# EAGLE design reembox (EAGLE 6.2)
Reembox 1.1 The project "reembox" © 2013 Jonas Eickhoff is licensed under the Creative Commons Attribution-ShareAlike 3.0 Unported License: http://creativecommons.org/licenses/by-sa/3.0/
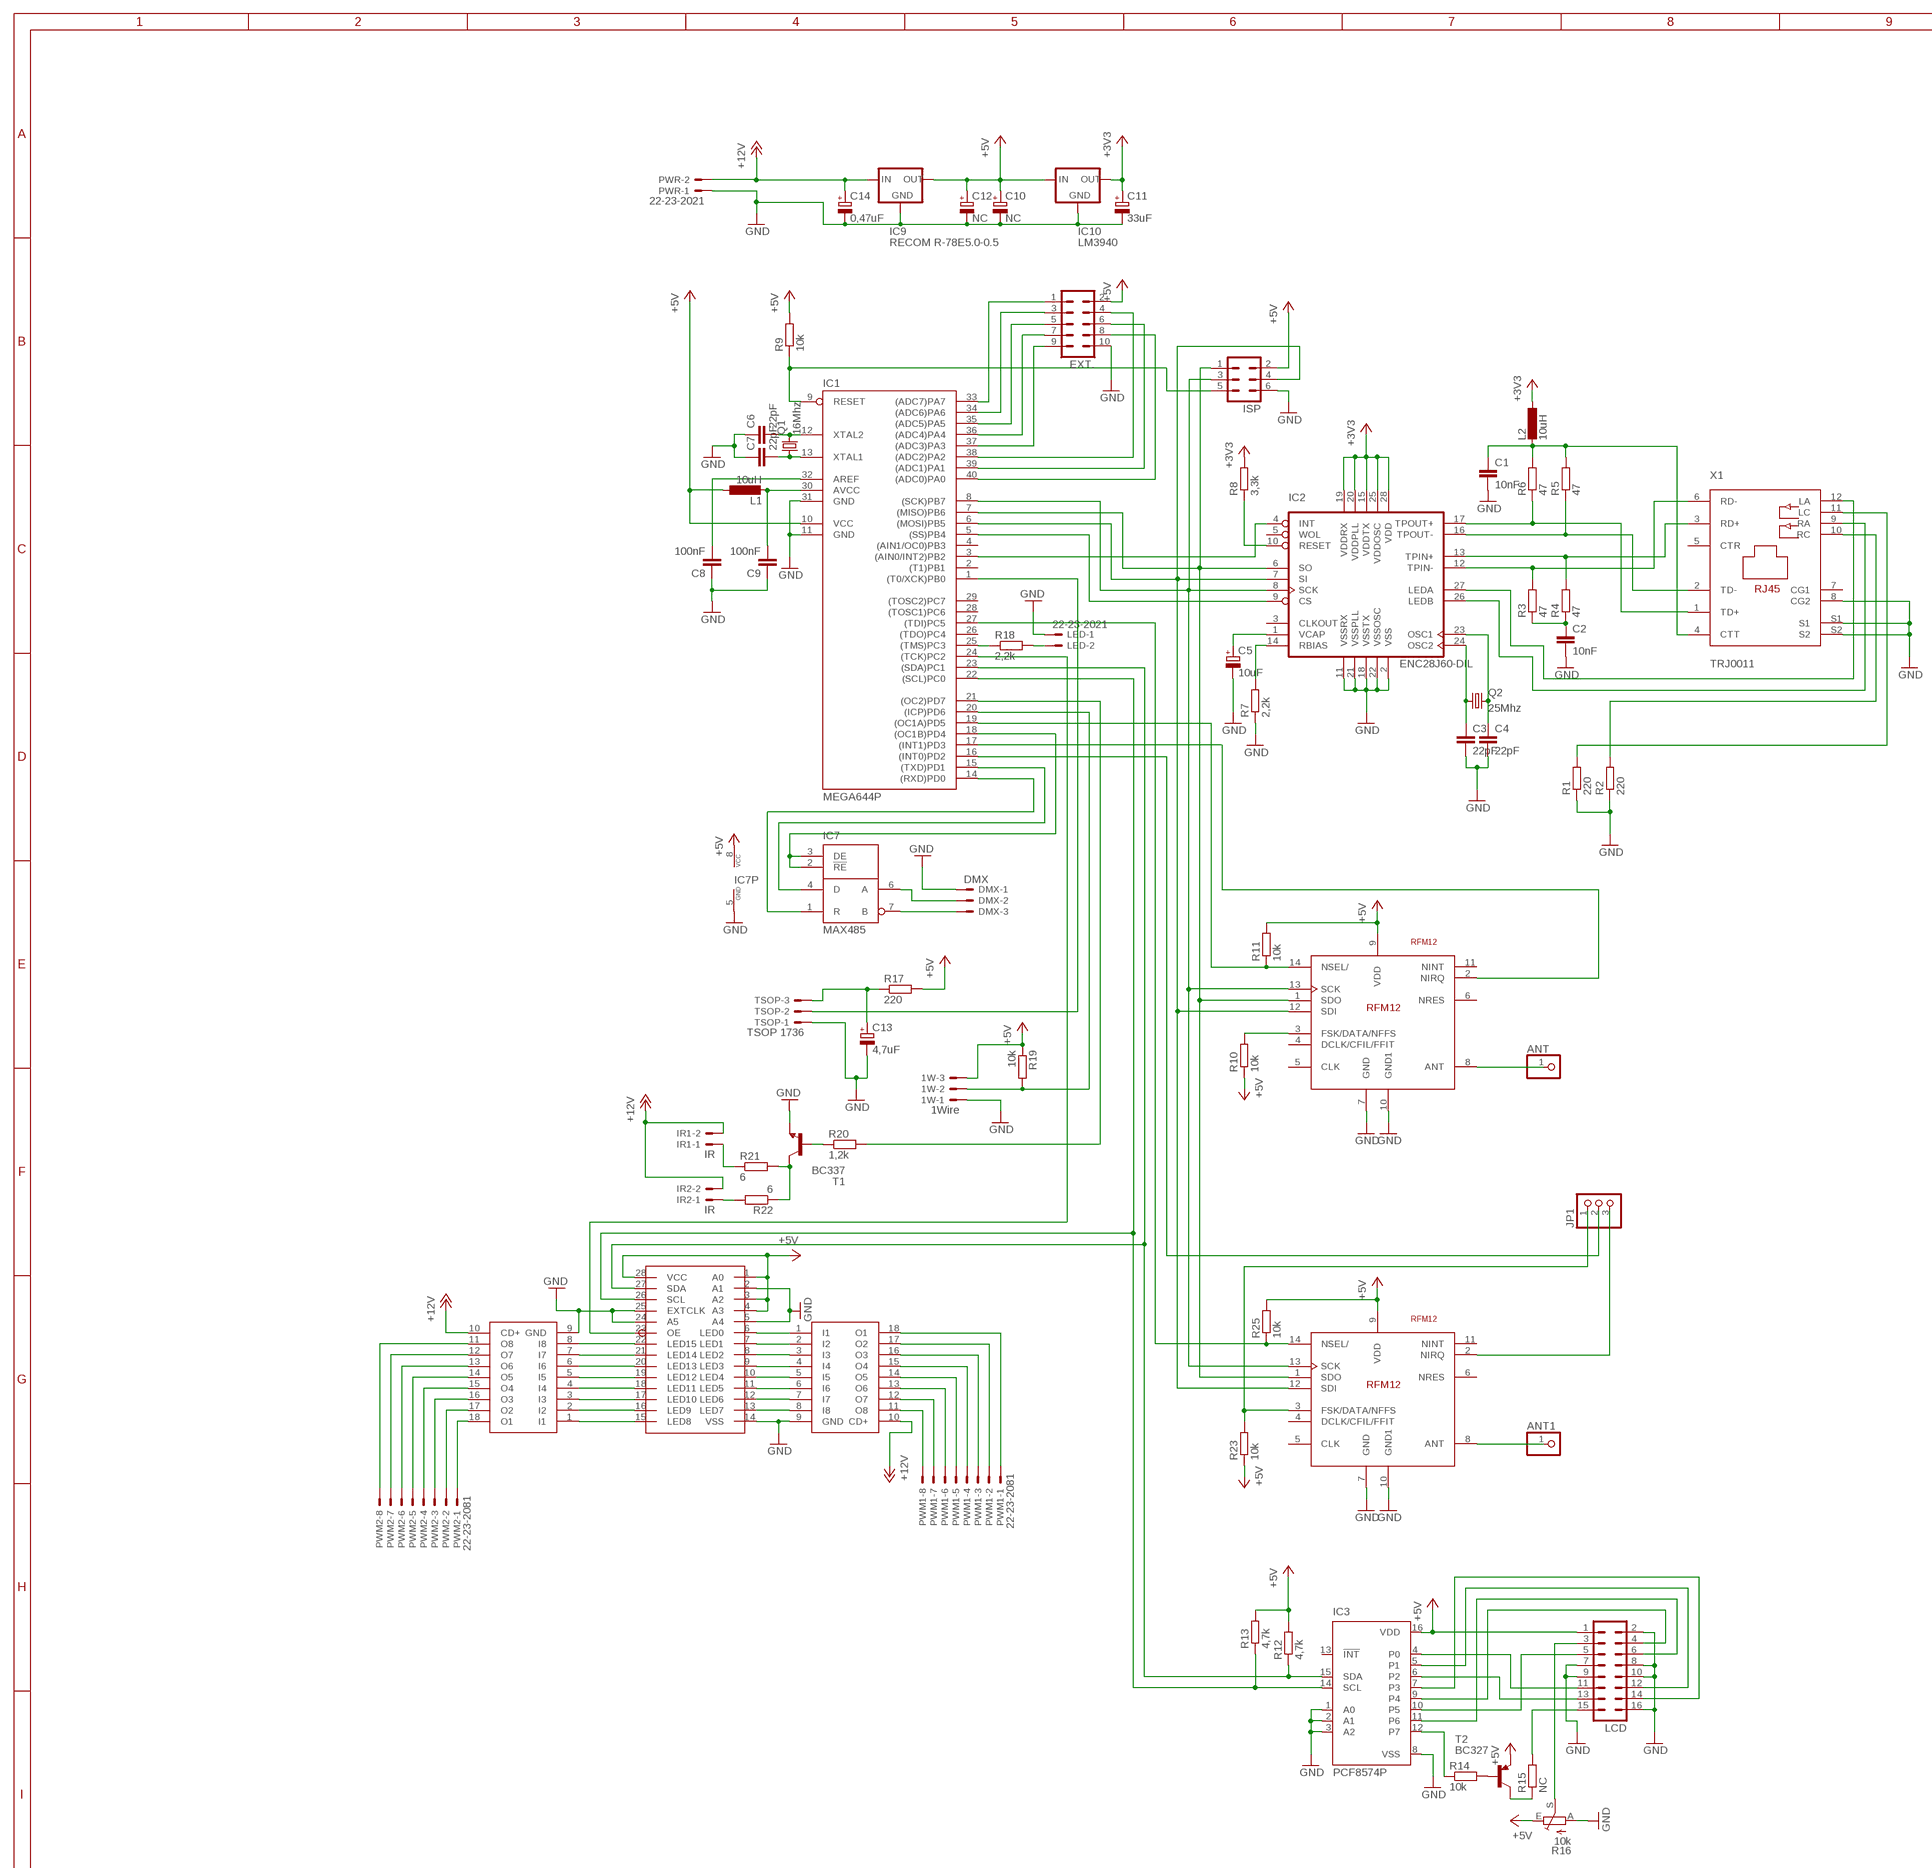
[diagram p0: schematic, sheet 1, part 1 of 2]
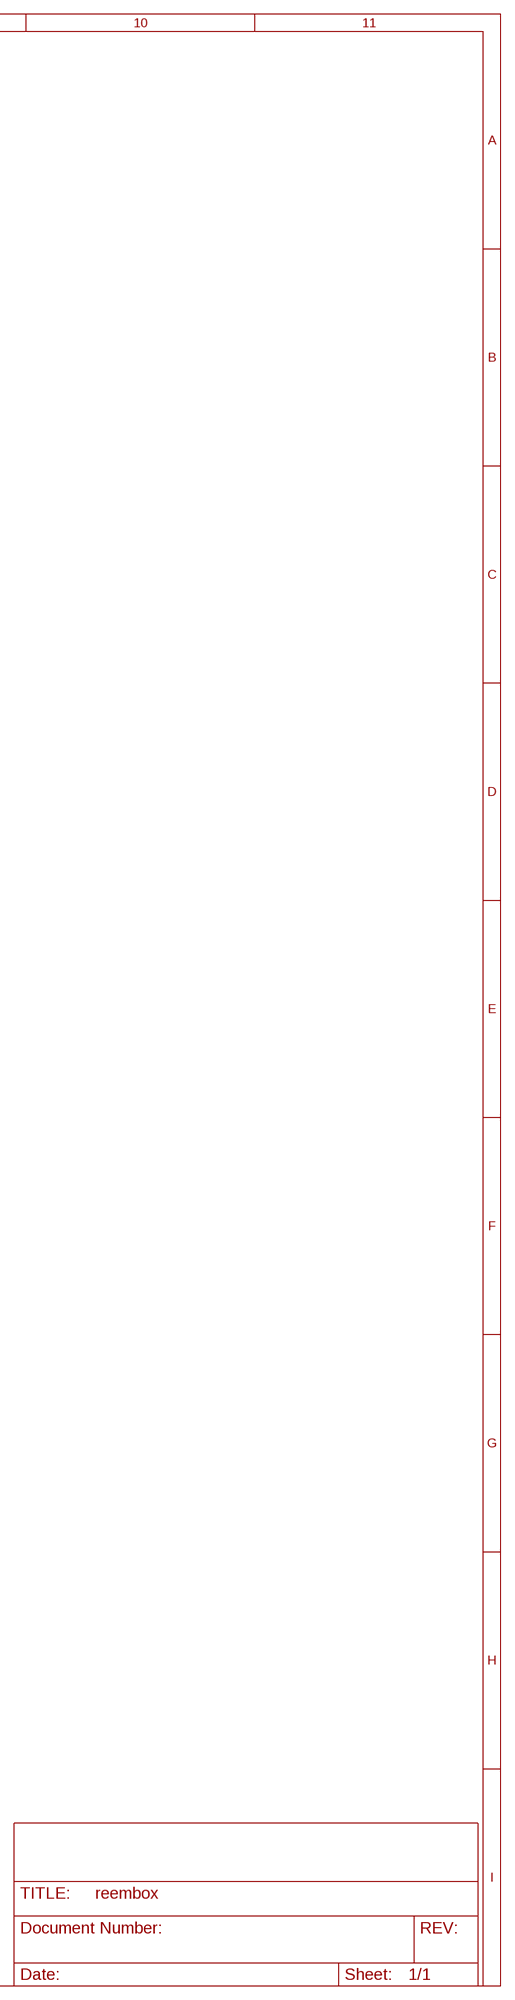
[diagram p1: schematic, sheet 1, part 2 of 2]

## Parts
1W  1Wire  CON-MOLEX_22-23-2031  [CON-MOLEX_22-23-2031]
ANT  PINHD-1X1  [1X01]
ANT1  PINHD-1X1  [1X01]
C1  10nF  C-EU050-025X075  [C050-025X075]
C2  10nF  C-EU050-025X075  [C050-025X075]
C3  22pF  C-EU050-024X044  [C050-024X044]
C4  22pF  C-EU050-024X044  [C050-024X044]
C5  10uF  CPOL-EUE2.5-6  [E2,5-6]
C6  22pF  C-EU050-024X044  [C050-024X044]
C7  22pF  C-EU050-024X044  [C050-024X044]
C8  100nF  C-EU050-025X075  [C050-025X075]
C9  100nF  C-EU050-025X075  [C050-025X075]
C10  NC  CPOL-EUE2.5-6  [E2,5-6]
C11  33uF  CPOL-EUE2.5-6  [E2,5-6]
C12  NC  CPOL-EUE2.5-6  [E2,5-6]
C13  4,7uF  CPOL-EUE2,5-6E  [E2,5-6E]
C14  0,47uF  CPOL-EUE2.5-6  [E2,5-6]
DMX  DMX  22-23-2031  [22-23-2031]
EXT.  ML10L  [ML10L]
IC1  MEGA644P  MEGA32-P  [DIL40]
IC2  ENC28J60-DIL  [DIL28-3]
IC3  PCF8574P  [DIL16]
IC4  PCA9685PW  [TSSOP28]
IC5  ULN2803  [DIL18]
IC6  ULN2803  [DIL18]
IC7  MAX485  75ALS176P  [DIL08]
IC8  RFM12  FRM12  [RFM12]
IC9  RECOM R-78E5.0-0.5  78XXS  [78XXS]
IC10  LM3940  78XXS  [78XXS]
IC11  RFM12  FRM12  [RFM12]
IR1  IR  22-23-2021  [22-23-2021]
IR2  IR  22-23-2021  [22-23-2021]
ISP  ML6  [ML6]
JP1  PINHD-1X3  [1X03]
L1  10uH  L-EU0207/2V  [0207/2V]
L2  10uH  L-EU0207/2V  [0207/2V]
LCD  ML16  [ML16]
LED  22-23-2021  [22-23-2021]
PWM1  22-23-2081  [22-23-2081]
PWM2  22-23-2081  [22-23-2081]
PWR  22-23-2021  [22-23-2021]
Q1  16Mhz  CRYSTALHC49U-V  [HC49U-V]
Q2  25Mhz  CRYSTALHC49U-V  [HC49U-V]
R1  220  R-EU_0207/2V  [0207/2V]
R2  220  R-EU_0207/2V  [0207/2V]
R3  47  R-EU_0207/2V  [0207/2V]
R4  47  R-EU_0207/2V  [0207/2V]
R5  47  R-EU_0207/2V  [0207/2V]
R6  47  R-EU_0207/2V  [0207/2V]
R7  2,2k  R-EU_0207/7  [0207/7]
R8  3,3k  R-EU_0207/10  [0207/10]
R9  10k  R-EU_0207/2V  [0207/2V]
R10  10k  R-EU_0207/10  [0207/10]
R11  10k  R-EU_0207/10  [0207/10]
R12  4,7k  R-EU_0207/10  [0207/10]
R13  4,7k  R-EU_0207/10  [0207/10]
R14  10k  R-EU_0207/10  [0207/10]
R15  NC  R-EU_0207/10  [0207/10]
R16  10k  TRIM_EU-PT10S  [PT-10S]
R17  220  R-EU_0207/2V  [0207/2V]
R18  2,2k  R-EU_0207/2V  [0207/2V]
R19  10k  R-EU_0207/10  [0207/10]
R20  1,2k  RCL_R-EU_0207/2V  [RCL_0207/2V]
R21  6  RCL_R-EU_0207/2V  [RCL_0207/2V]
R22  6  RCL_R-EU_0207/2V  [RCL_0207/2V]
R23  10k  R-EU_0207/10  [0207/10]
R25  10k  R-EU_0207/2V  [0207/2V]
T1  BC337  [TO92]
T2  BC327  [TO92]
TSOP  TSOP 1736  22-23-2031  [22-23-2031]
X1  TRJ0011  [TRJ0011]

## Nets
+3V3: C11.+ IC2.15(VDDTX) IC2.19(VDDRX) IC2.20(VDDPLL) IC2.25(VDDOSC) IC2.28(VDD) IC10.OUT L2.1 R8.2
+5V: 1W.3 C10.+ C12.+ EXT..2 IC1.10(VCC) IC3.16(VDD) IC4.1(A0) IC4.3(A2) IC4.4(A3) IC4.28(VCC) IC7.8(VCC) IC8.9(VDD) IC9.OUT IC10.IN IC11.9(VDD) ISP.2 L1.1 LCD.1 R9.2 R10.1 R11.2 R12.2 R13.2 R16.E R17.2 R19.1 R23.1 R25.2 T2.1(E)
+12V: C14.+ IC5.10(CD+) IC6.10(CD+) IC9.IN IR1.2 IR2.2 PWR.2
GND: 1W.1 C1.2 C2.2 C3.2 C4.2 C5.- C6.1 C7.1 C8.1 C9.1 C10.- C11.- C12.- C13.- C14.- DMX.1 EXT..10 IC1.11(GND) IC1.31(GND) IC2.2(VSS) IC2.11(VSSRX) IC2.18(VSSTX) IC2.21(VSSPLL) IC2.22(VSSOSC) IC3.1(A0) IC3.2(A1) IC3.3(A2) IC3.8(VSS) IC4.2(A1) IC4.5(A4) IC4.14(VSS) IC4.24(A5) IC4.25(EXTCLK) IC5.9(GND) IC6.9(GND) IC7.5(GND) IC8.7(GND) IC8.10(GND1) IC9.GND IC10.GND IC11.7(GND) IC11.10(GND1) ISP.6 LCD.2 LCD.7 LCD.8 LCD.9 LCD.10 LCD.16 LED.1 PWR.1 R1.1 R2.1 R7.1 R16.A T1.1(E) TSOP.1 X1.8(CG2) X1.S1 X1.S2
LED: IC1.1((T0/XCK)PB0) TSOP.2
N$1: IC2.17(TPOUT+) R6.1 X1.1(TD+)
N$2: IC2.16(TPOUT-) R5.1 X1.2(TD-)
N$3: IC2.13(TPIN+) R4.2 X1.3(RD+)
N$4: IC2.12(TPIN-) R3.2 X1.6(RD-)
N$5: IC2.27(LEDA) X1.12(LA)
N$6: IC2.26(LEDB) X1.9(RA)
N$7: R2.2 X1.10(RC)
N$8: R1.2 X1.11(LC)
N$9: C2.1 R3.1 R4.1
N$10: C3.1 IC2.24(OSC2) Q2.1
N$11: C4.1 IC2.23(OSC1) Q2.2
N$12: C1.1 L2.2 R5.2 R6.2 X1.4(CTT)
N$13: IC2.10(RESET) R8.1
N$14: IC2.14(RBIAS) R7.2
N$15: C5.+ IC2.1(VCAP)
N$16: C6.2 IC1.12(XTAL2) Q1.2
N$17: C7.2 IC1.13(XTAL1) Q1.1
N$18: IC1.5((SS)PB4) IC2.9(CS)
N$19: IC1.17((INT1)PD3) IC8.2(NIRQ)
N$20: IC1.27((TDI)PC5) IC11.14(NSEL/) R25.1
N$21: IC1.16((INT0)PD2) JP1.2
N$22: C8.2 IC1.32(AREF)
N$23: IC1.3((AIN0/INT2)PB2) IC2.4(INT)
N$24: IC1.9(RESET) ISP.5 R9.1
N$25: IC1.19((OC1A)PD5) IC8.14(NSEL/) R11.1
N$26: C9.2 IC1.30(AVCC) L1.2
N$27: DMX.2 IC7.6(A)
N$29: IC1.18((OC1B)PD4) IC7.2(!RE) IC7.3(DE)
N$30: DMX.3 IC7.7(B)
N$32: IC1.15((TXD)PD1) IC7.4(D)
N$33: IC1.14((RXD)PD0) IC7.1(R)
N$34: IC1.23((SDA)PC1) IC3.15(SDA) IC4.27(SDA) R12.1
N$35: IC1.22((SCL)PC0) IC3.14(SCL) IC4.26(SCL) R13.1
N$36: IC3.12(P7) R14.1
N$37: R14.2 T2.2(B)
N$38: R15.1 T2.3(C)
N$39: LCD.15 R15.2
N$40: IC3.4(P0) LCD.11
N$41: IC3.5(P1) LCD.12
N$42: IC3.6(P2) LCD.13
N$43: IC3.7(P3) LCD.14
N$44: IC3.9(P4) LCD.4
N$45: IC3.10(P5) LCD.5
N$46: IC3.11(P6) LCD.6
N$47: ANT.1 IC8.8(ANT)
N$48: IC1.24((TCK)PC2) IC4.23(OE)
N$49: LCD.3 R16.S
N$50: C13.+ R17.1 TSOP.3
N$51: IC4.15(LED8) IC5.1(I1)
N$52: IC1.21((OC2)PD7) R20.2
N$53: IC1.8((SCK)PB7) IC2.8(SCK) IC8.13(SCK) IC11.13(SCK) ISP.3
N$54: 1W.2 IC1.20((ICP)PD6) R19.2
N$55: R20.1 T1.2(B)
N$56: IC4.16(LED9) IC5.2(I2)
N$57: R21.2 R22.1 T1.3(C)
N$58: IR1.1 R21.1
N$59: IC4.17(LED10) IC5.3(I3)
N$60: IC4.18(LED11) IC5.4(I4)
N$61: IC4.19(LED12) IC5.5(I5)
N$62: IC4.20(LED13) IC5.6(I6)
N$63: IC4.21(LED14) IC5.7(I7)
N$64: IC4.22(LED15) IC5.8(I8)
N$65: IC4.6(LED0) IC6.1(I1)
N$66: IC4.8(LED2) IC6.3(I3)
N$67: IC4.7(LED1) IC6.2(I2)
N$68: IC4.10(LED4) IC6.5(I5)
N$69: IC4.9(LED3) IC6.4(I4)
N$70: IC4.12(LED6) IC6.7(I7)
N$71: IC4.11(LED5) IC6.6(I6)
N$72: IC4.13(LED7) IC6.8(I8)
N$73: IC6.13(O6) PWM1.6
N$74: IC6.17(O2) PWM1.2
N$75: IC5.18(O1) PWM2.1
N$76: IC5.17(O2) PWM2.2
N$77: IC5.16(O3) PWM2.3
N$78: IC5.15(O4) PWM2.4
N$79: IC5.14(O5) PWM2.5
N$80: IC5.13(O6) PWM2.6
N$81: IC5.12(O7) PWM2.7
N$82: IC5.11(O8) PWM2.8
N$83: IC6.11(O8) PWM1.8
N$84: IC6.12(O7) PWM1.7
N$85: IC6.14(O5) PWM1.5
N$86: IC6.15(O4) PWM1.4
N$87: IC6.16(O3) PWM1.3
N$88: IC6.18(O1) PWM1.1
N$89: IC1.25((TMS)PC3) R18.1
N$90: EXT..1 IC1.33((ADC7)PA7)
N$91: EXT..3 IC1.34((ADC6)PA6)
N$92: EXT..5 IC1.35((ADC5)PA5)
N$93: EXT..7 IC1.36((ADC4)PA4)
N$94: EXT..9 IC1.37((ADC3)PA3)
N$95: EXT..4 IC1.38((ADC2)PA2)
N$96: EXT..6 IC1.39((ADC1)PA1)
N$97: EXT..8 IC1.40((ADC0)PA0)
N$98: IC1.6((MOSI)PB5) IC2.7(SI) IC8.12(SDI) IC11.12(SDI) ISP.4
N$99: LED.2 R18.2
N$100: IR2.1 R22.2
N$101: IC1.7((MISO)PB6) IC2.6(SO) IC8.1(SDO) IC11.1(SDO) ISP.1
N$103: IC11.3(FSK/DATA/NFFS) JP1.1 R23.2
N$104: IC11.2(NIRQ) JP1.3
N$105: ANT1.1 IC11.8(ANT)
N$106: IC8.3(FSK/DATA/NFFS) R10.2
Unconnected: IC1.2((T1)PB1) IC1.4((AIN1/OC0)PB3) IC1.26((TDO)PC4) IC1.28((TOSC1)PC6) IC1.29((TOSC2)PC7) IC2.3(CLKOUT) IC2.5(WOL) IC3.13(!INT) IC8.4(DCLK/CFIL/FFIT) IC8.5(CLK) IC8.6(NRES) IC8.11(NINT) IC11.4(DCLK/CFIL/FFIT) IC11.5(CLK) IC11.6(NRES) IC11.11(NINT) X1.5(CTR) X1.7(CG1)

## Notes on the sheet
- This project "reembox" © 2013 Jonas Eickhoff is licensed under the Creative Commons Attribution-ShareAlike 3.0 Unported License: http://creativecommons.org/licenses/by-sa/3.0/

## Library data of the parts
1W = NetIO:CON-MOLEX_22-23-2031: .100" (2.54mm) Center Header - 3 Pin; MF: MOLEX; MPN: 22-23-2031; OC_FARNELL: 1462950; OC_NEWARK: 30C0862
ANT ANT1 = pinhead:PINHD-1X1: PIN HEADER
C1-C4 C6-C9 = rcl:C-EU: CAPACITOR, European symbol
C5 C10-C14 = rcl:CPOL-EU: POLARIZED CAPACITOR, European symbol
DMX TSOP = con-molex:22-23-2031: .100" (2.54mm) Center Header - 3 Pin; MF: MOLEX; MPN: 22-23-2031; OC_FARNELL: 1462950; OC_NEWARK: 30C0862
EXT. = con-ml:ML10L: HARTING; OC_FARNELL: unknown; OC_NEWARK: unknown
IC1 = atmel:MEGA32-P: MICROCONTROLLER 32 Kbytes FLASH 2 Kbytes SRAM 1 Kbytes EEPROM USART 8-channel 10 bit ADC Source: www.atmel.com .. doc2503.pdf; MPN: ATMEGA32-16PU; OC_FARNELL: 1661729; OC_NEWARK: 51P1794
IC2 = enc28j60centered:ENC28J60-*: Microchip 10Mbit Ethernet controller with SPI interface Improved SOIC28 layout (pads in 0.01 raster, pin1 slightly smaller). Pin 6 (SO) changed from Out (paralleling several Outs gives an error) to OC. Author: Profi from mikrocontroller.net - forum Date: 2006.0827
IC3 = micro-philips:PCF8574: I2C-Bus Remote 8-bit I/O expander http://www.semiconductors.philips.com/acrobat_download/datasheets/PCF8574_4.pdf; MPN: PCF8574PN; OC_FARNELL: 204020; OC_NEWARK: 11N8515
IC4 = PCA9685PW:PCA9685PW
IC5 IC6 = ULN2803:ULN2803
IC7 = texas:75ALS176: DIFFERENTIAL BUS TRANSCEIVERS TIA/EIA-422-B, TIA/EIA-422-B + TIA/EIA-422-B TIA/EIA-422-B Operate at Data Rates up to 35 Mbaud Source: http://focus.ti.com/lit/ds/symlink/sn65als176.pdf; MF: TEXAS INSTRUMENTS; MPN: SN75ALS176P; OC_FARNELL: 1103021; OC_NEWARK: 60K6915
IC8 IC11 = RFM12:FRM12
IC9 IC10 = v-reg:78XXS: VOLTAGE REGULATOR
IR1 IR2 LED PWR = con-molex:22-23-2021: .100" (2.54mm) Center Header - 2 Pin; MF: MOLEX; MPN: 22-23-2021; OC_FARNELL: 1462926; OC_NEWARK: 25C3832
ISP = con-ml:ML6: HARTING; OC_FARNELL: unknown; OC_NEWARK: unknown
JP1 = pinhead:PINHD-1X3: PIN HEADER
L1 L2 = rcl:L-EU: INDUCTOR, European symbol
LCD = con-ml:ML16: HARTING; OC_FARNELL: unknown; OC_NEWARK: unknown
PWM1 PWM2 = con-molex:22-23-2081: .100" (2.54mm) Center Header - 8 Pin; MF: MOLEX; MPN: 22-23-2081; OC_FARNELL: 1756826; OC_NEWARK: 01C7592
Q1 Q2 = crystal:CRYSTAL: CRYSTAL; OC_FARNELL: 1666969; OC_NEWARK: unknown
R1-R6 R8-R15 R17-R19 R23 R25 = rcl:R-EU_: RESISTOR, European symbol
R7 = resistor:R-EU_: RESISTOR, European symbol
R16 = pot:TRIM_EU-: POTENTIOMETER
R20-R22 = NetIO:RCL_R-EU_: RESISTOR, European symbol
T1 = transistor:BC337: NPN TRANSISTOR
T2 = transistor-pnp:BC327: PNP Transistor
X1 = trj0011:TRJ0011

## Board
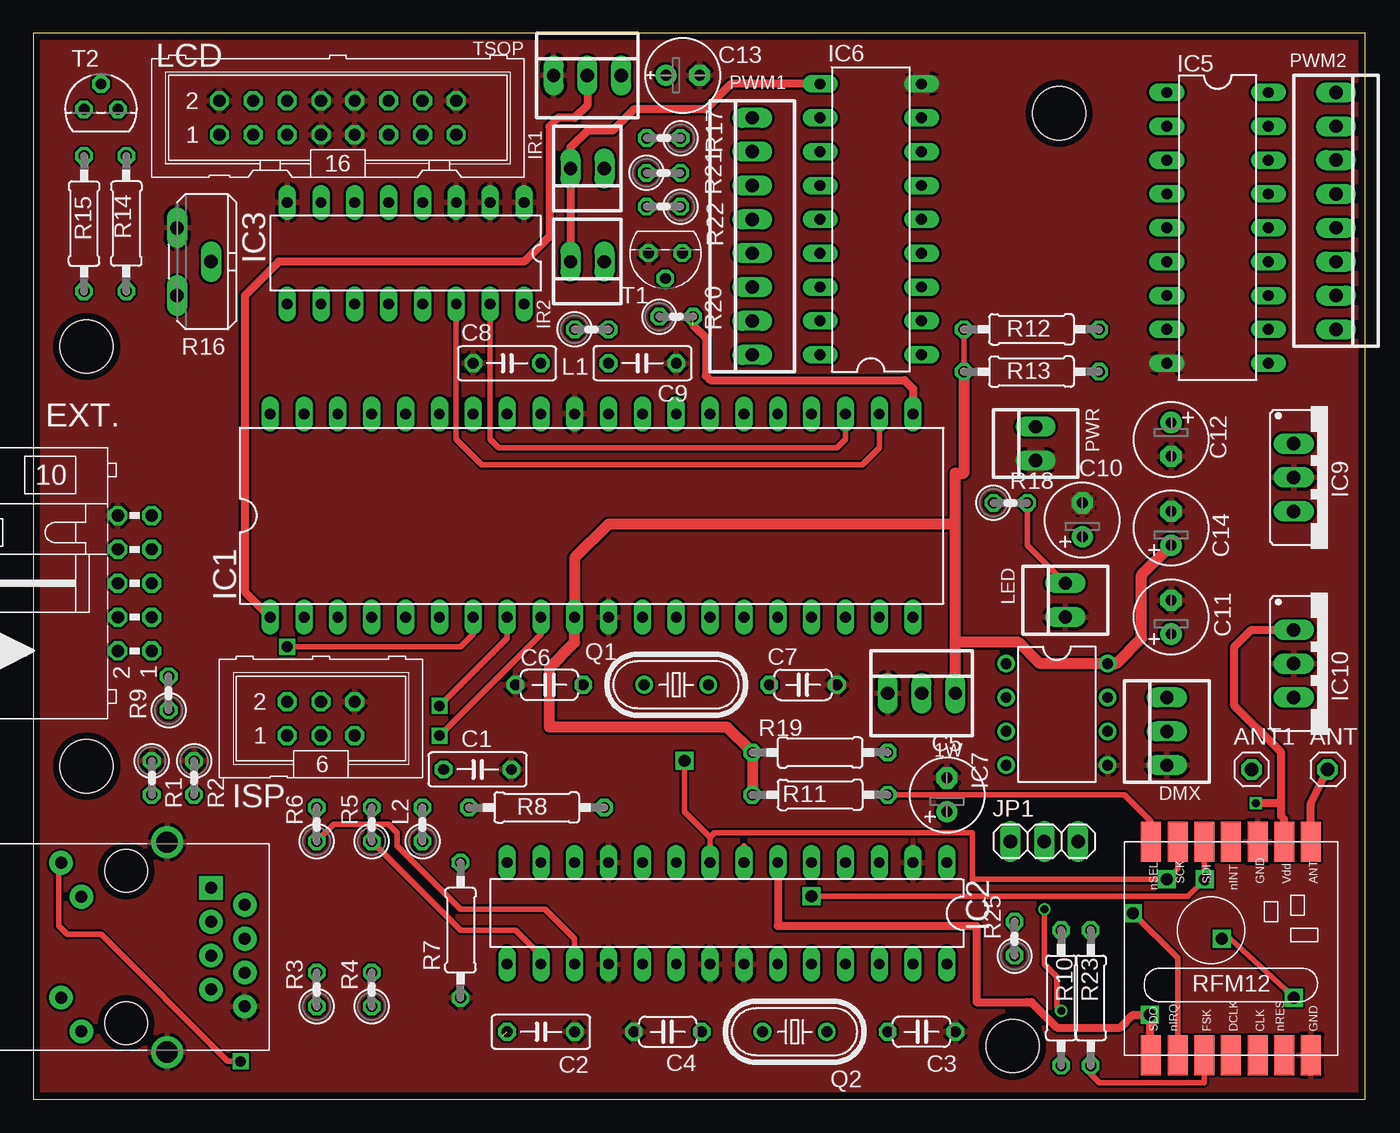
[diagram p2: board, top side]
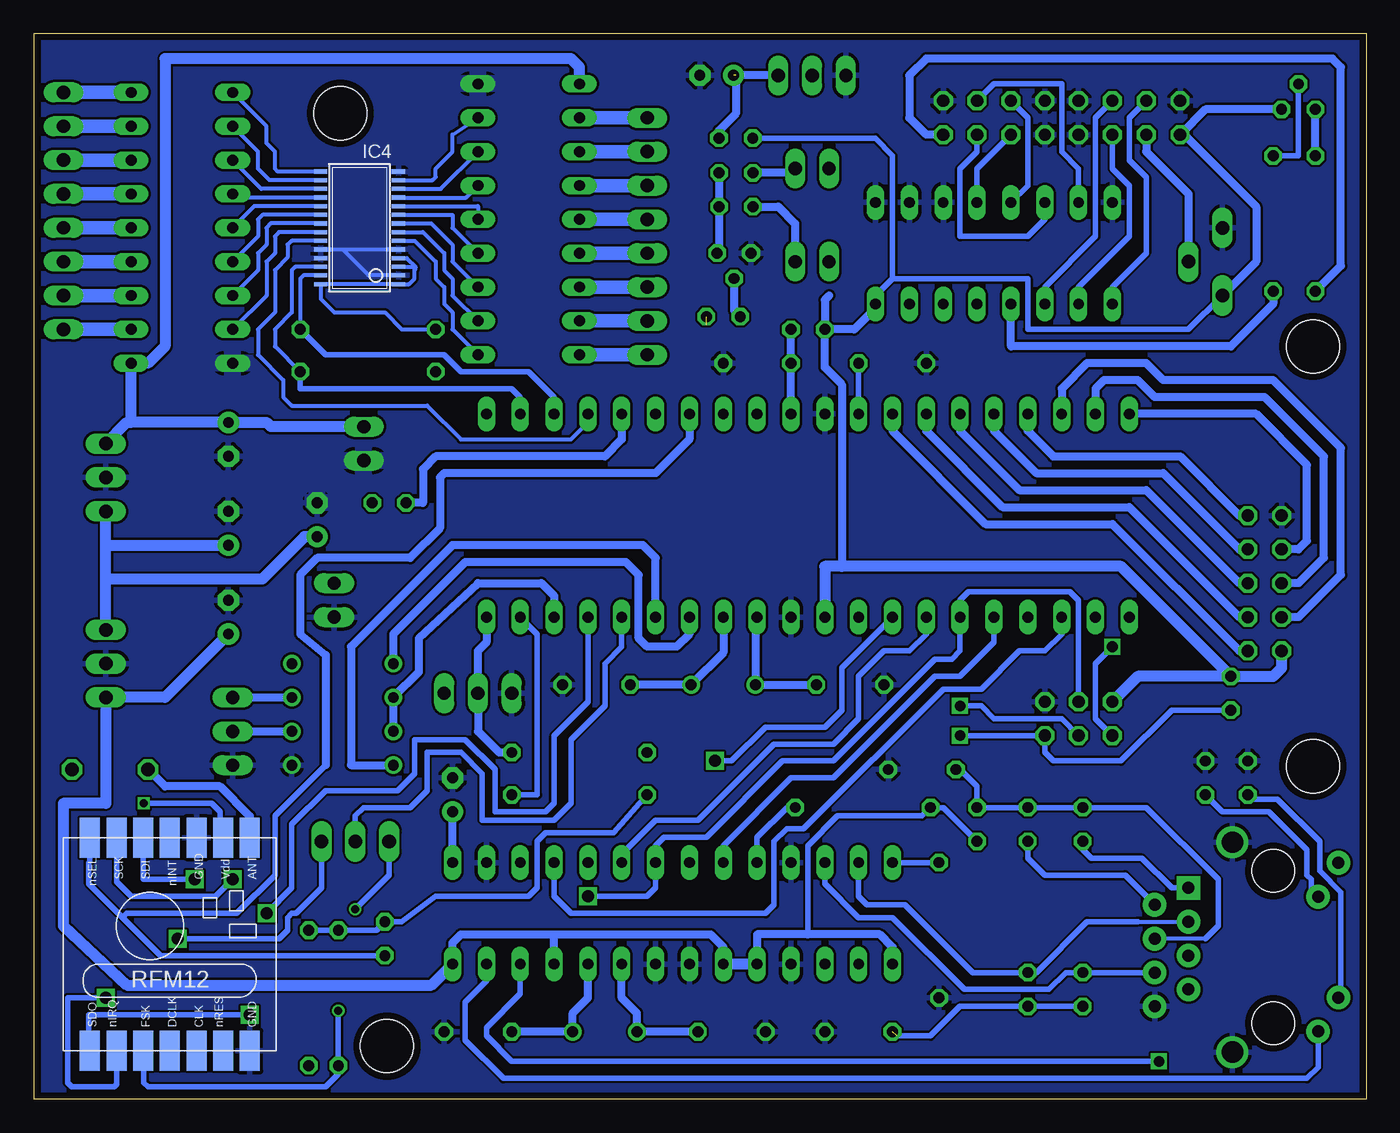
[diagram p3: board, bottom side, seen from below]

Size 100 x 80 mm. Coordinates in mm from the lower left corner, seen from the top.
Outline: 0,0 100,0 100,80 0,80 0,0
Copper layers (1*16): Top 0.035mm / dielectric 1.5mm / Bottom 0.035mm
Design rules: minimum track width 7mil, minimum drill 12mil, track to track 7mil, track to pad 7mil, pad to pad 7mil, via to via 7mil, smd to smd 0mil, copper to edge 20mil, drill to drill 10mil, minimum pad ring 10mil, minimum via ring 6mil, stop-mask expansion 2mil, vias tented up to drill 25mil, thermal gap 10mil
Holes 4 mm at 4,25 4,56.5 77,74 73.5,4

### Footprints (pad centres in the part's own frame; a part is rotated, then mirrored left to right if it is on the bottom)
CON-MOLEX_22-23-2031 = drill 1 long: 1 -2.54,0; 2 0,0; 3 2.54,0
1X01 = drill 1.016 octagon: 1 0,0
C050-025X075 = drill 0.813 octagon: 1 -2.54,0; 2 2.54,0
C050-024X044 = drill 0.813 octagon: 1 -2.54,0; 2 2.54,0
E2,5-6 = drill 0.813 pad 1.6: + -1.27,0 | drill 0.813 pad 1.6 octagon: - 1.27,0
E2,5-6E = drill 0.813 pad 1.575: + -1.27,0 | drill 0.813 pad 1.575 octagon: - 1.27,0
22-23-2031 = drill 1 long: 1 -2.54,0; 2 0,0; 3 2.54,0
ML10L = drill 0.914 octagon: 1 -5.08,-1.27; 2 -5.08,1.27; 3 -2.54,-1.27; 4 -2.54,1.27; 5 0,-1.27; 6 0,1.27; 7 2.54,-1.27; 8 2.54,1.27; 9 5.08,-1.27; 10 5.08,1.27
DIL40 = drill 0.813 long: 1 -24.13,-7.62; 2 -21.59,-7.62; 3 -19.05,-7.62; 4 -16.51,-7.62; 5 -13.97,-7.62; 6 -11.43,-7.62; 7 -8.89,-7.62; 8 -6.35,-7.62; 9 -3.81,-7.62; 10 -1.27,-7.62; 11 1.27,-7.62; 12 3.81,-7.62; 13 6.35,-7.62; 14 8.89,-7.62; 15 11.43,-7.62; 16 13.97,-7.62; 17 16.51,-7.62; 18 19.05,-7.62; 19 21.59,-7.62; 20 24.13,-7.62; 21 24.13,7.62; 22 21.59,7.62; 23 19.05,7.62; 24 16.51,7.62; 25 13.97,7.62; 26 11.43,7.62; 27 8.89,7.62; 28 6.35,7.62; 29 3.81,7.62; 30 1.27,7.62; 31 -1.27,7.62; 32 -3.81,7.62; 33 -6.35,7.62; 34 -8.89,7.62; 35 -11.43,7.62; 36 -13.97,7.62; 37 -16.51,7.62; 38 -19.05,7.62; 39 -21.59,7.62; 40 -24.13,7.62
DIL28-3 = drill 0.813 long: 1 -16.51,-3.81; 2 -13.97,-3.81; 3 -11.43,-3.81; 4 -8.89,-3.81; 5 -6.35,-3.81; 6 -3.81,-3.81; 7 -1.27,-3.81; 8 1.27,-3.81; 9 3.81,-3.81; 10 6.35,-3.81; 11 8.89,-3.81; 12 11.43,-3.81; 13 13.97,-3.81; 14 16.51,-3.81; 15 16.51,3.81; 16 13.97,3.81; 17 11.43,3.81; 18 8.89,3.81; 19 6.35,3.81; 20 3.81,3.81; 21 1.27,3.81; 22 -1.27,3.81; 23 -3.81,3.81; 24 -6.35,3.81; 25 -8.89,3.81; 26 -11.43,3.81; 27 -13.97,3.81; 28 -16.51,3.81
DIL16 = drill 0.813 long: 1 -8.89,-3.81; 2 -6.35,-3.81; 3 -3.81,-3.81; 4 -1.27,-3.81; 5 1.27,-3.81; 6 3.81,-3.81; 7 6.35,-3.81; 8 8.89,-3.81; 9 8.89,3.81; 10 6.35,3.81; 11 3.81,3.81; 12 1.27,3.81; 13 -1.27,3.81; 14 -3.81,3.81; 15 -6.35,3.81; 16 -8.89,3.81
TSSOP28 = smd 0.305 x 0.991: 1 -4.225,-2.918; 2 -3.575,-2.918; 3 -2.925,-2.918; 4 -2.275,-2.918; 5 -1.625,-2.918; 6 -0.975,-2.918; 7 -0.325,-2.918; 8 0.325,-2.918; 9 0.975,-2.918; 10 1.625,-2.918; 11 2.275,-2.918; 12 2.925,-2.918; 13 3.575,-2.918; 14 4.225,-2.918; 15 4.225,2.918; 16 3.575,2.918; 17 2.925,2.918; 18 2.275,2.918; 19 1.625,2.918; 20 0.975,2.918; 21 0.325,2.918; 22 -0.325,2.918; 23 -0.975,2.918; 24 -1.625,2.918; 25 -2.275,2.918; 26 -2.925,2.918; 27 -3.575,2.918; 28 -4.225,2.918
DIL18 = drill 0.813 long: 1 -10.16,-3.81; 2 -7.62,-3.81; 3 -5.08,-3.81; 4 -2.54,-3.81; 5 0,-3.81; 6 2.54,-3.81; 7 5.08,-3.81; 8 7.62,-3.81; 9 10.16,-3.81; 10 10.16,3.81; 11 7.62,3.81; 12 5.08,3.81; 13 2.54,3.81; 14 0,3.81; 15 -2.54,3.81; 16 -5.08,3.81; 17 -7.62,3.81; 18 -10.16,3.81
DIL08 = drill 0.813 pad 1.27: 1 -3.81,-3.81; 2 -1.27,-3.81; 3 1.27,-3.81; 4 3.81,-3.81; 5 3.81,3.81; 6 1.27,3.81; 7 -1.27,3.81; 8 -3.81,3.81
RFM12 = smd 1.5 x 3: 1 -5,-10; 2 -3,-10; 3 -1,-10; 4 1,-10; 5 3,-10; 6 5,-10; 7 7,-10; 8 7,6; 9 5,6; 10 3,6; 11 1,6; 12 -1,6; 13 -3,6; 14 -5,6
78XXS = drill 1.016 long: GND 0,-2.54; IN -2.54,-2.54; OUT 2.54,-2.54
22-23-2021 = drill 1 long: 1 -1.27,0; 2 1.27,0
ML6 = drill 0.914 octagon: 1 -2.54,-1.27; 2 -2.54,1.27; 3 0,-1.27; 4 0,1.27; 5 2.54,-1.27; 6 2.54,1.27
1X03 = drill 1.016 long: 1 -2.54,0; 2 0,0; 3 2.54,0
0207/2V = drill 0.813 octagon: 1 -1.27,0; 2 1.27,0
ML16 = drill 0.914 octagon: 1 -8.89,-1.27; 2 -8.89,1.27; 3 -6.35,-1.27; 4 -6.35,1.27; 5 -3.81,-1.27; 6 -3.81,1.27; 7 -1.27,-1.27; 8 -1.27,1.27; 9 1.27,-1.27; 10 1.27,1.27; 11 3.81,-1.27; 12 3.81,1.27; 13 6.35,-1.27; 14 6.35,1.27; 15 8.89,-1.27; 16 8.89,1.27
22-23-2081 = drill 1 long: 1 -8.89,0; 2 -6.35,0; 3 -3.81,0; 4 -1.27,0; 5 1.27,0; 6 3.81,0; 7 6.35,0; 8 8.89,0
HC49U-V = drill 0.813: 1 -2.413,0; 2 2.413,0
0207/10 = drill 0.813 octagon: 1 -5.08,0; 2 5.08,0
PT-10S = drill 1.016 long: A -2.54,-1.27; E 2.54,-1.27; S 0,1.27
RCL_0207/2V = drill 0.813 octagon: 1 -1.27,0; 2 1.27,0
TO92 = drill 0.813 octagon: 1 1.27,0; 2 0,1.905; 3 -1.27,0
TRJ0011 = drill 0.9 pad 1.778 square: 1 4.445,-6.35 | drill 0.9 pad 1.778: 2 3.175,-8.89; 3 1.905,-6.35; 4 0.635,-8.89; 5 -0.635,-6.35; 6 -1.905,-8.89; 7 -3.175,-6.35; 8 -4.445,-8.89; 9 6.325,4.902; 10 3.785,3.378; 11 -3.785,4.902; 12 -6.325,3.378 | drill 1.6: S1 -7.874,-3.048; S2 7.874,-3.048 | hole 3.2: -5.715,0; 5.715,0

### Placement (x,y rotation side)
1W  66.67,30.48 0 top
ANT  97.16,24.77 0 top
ANT1  91.44,24.77 0 top
C1  33.34,24.77 0 top
C2  38.1,5.08 0 top
C3  66.67,5.08 0 top
C4  47.62,5.08 180 top
C5  68.58,22.86 90 top
C6  38.73,31.11 0 top
C7  57.78,31.11 180 top
C8  35.56,55.24 0 top
C9  45.72,55.24 180 top
C10  78.74,43.5 90 top
C11  85.41,36.2 90 top
C12  85.41,42.86 90 top
C13  48.75,76.85 0 top
C14  85.41,49.53 270 top
DMX  85.09,27.62 90 top
EXT.  7.62,38.73 90 top
IC1  41.91,43.81 0 top
IC2  52.07,13.97 180 top
IC3  27.94,63.5 180 top
IC4  75.56,65.41 90 bottom
IC5  88.9,65.41 270 top
IC6  62.87,66.04 90 top
IC7  76.83,28.89 270 top
IC8  88.9,13.34 0 top
IC9  97.16,46.67 270 top
IC10  97.16,32.7 270 top
IC11  90.81,13.65 0 bottom
IR1  41.59,69.85 180 top
IR2  41.59,62.87 180 top
ISP  21.59,28.57 0 top
JP1  75.88,19.37 0 top
L1  41.91,57.78 0 top
L2  29.21,20.64 90 top
LCD  22.86,73.66 0 top
LED  77.47,37.47 90 top
PWM1  53.98,64.77 90 top
PWM2  97.79,66.67 270 top
PWR  75.25,49.21 90 top
Q1  48.26,31.11 180 top
Q2  57.15,5.08 180 top
R1  8.89,24.13 270 top
R2  12.06,24.13 270 top
R3  21.27,8.26 90 top
R4  25.4,8.26 90 top
R5  25.4,20.64 90 top
R6  21.27,20.64 90 top
R7  2,2k  [0207/10]  32.07,12.7 90 top
R8  37.78,21.91 180 top
R9  10.16,30.48 90 top
R10  79.38,7.62 270 top
R11  59.05,22.86 180 top
R12  74.93,57.78 180 top
R13  74.93,54.61 180 top
R14  6.99,65.72 90 top
R15  3.81,65.72 270 top
R16  12.06,62.87 270 top
R17  47.31,72.14 180 top
R18  73.34,44.77 0 top
R19  59.05,26.04 0 top
R20  48.26,58.74 0 top
R21  47.31,69.53 0 top
R22  47.31,66.99 180 top
R23  77.15,7.62 270 top
R25  73.66,12.06 90 top
T1  47.45,63.51 180 top
T2  5.08,74.3 0 top
TSOP  41.59,76.83 0 top
X1  6.99,11.43 90 top

### Tracks (layer width: path | path; a pad name or v marks a point on that pad's centre or on a via)
+3V3
  Bottom 0.406: L2.1 31.75,21.91 R8.2 33.34,21.27 39.69,21.27 41.91,19.05 41.91,12.38
  Bottom 0.61: IC2.25 60.96,12.38 | 60.96,12.38 49.21,12.38 48.26,11.43 IC2.20 | IC2.15 35.56,11.43 36.51,12.38 41.91,12.38 45.72,12.38 IC2.19 | IC2.28 68.58,11.75 67.94,12.38 60.96,12.38
  Bottom 0.813: IC2.19 IC2.20 | C11.+ 90.17,30.16 IC10.OUT 94.61,22.23 97.79,22.23 97.79,13.02 93.03,8.57 70.17,8.57 IC2.28
+5V  (via drill 0.6)
  Top 0.406: R12.2 R13.2
  Top 0.61: IC8.9 93.9,21.04 93.66,21.27 93.66,22.23 | 93.66,22.23 93.66,26.04 90.17,29.53 90.17,33.97 91.44,35.24 IC10.IN | 93.66,22.23 v91.76,22.23
  Top 0.813: R11.2 R19.1 52.07,27.94 38.73,27.94 38.73,32.38 40.64,34.29 IC1.10 40.64,40.64 43.18,43.18 69.22,43.18 | 69.22,43.18 69.22,46.99 69.85,46.99 R13.2 | C12.+ 83.19,39.37 83.19,34.61 81.28,32.7 IC7.8 75.56,32.7 73.98,34.29 69.22,34.29 | 1W.3 69.22,34.29 | 69.22,34.29 69.22,43.18
  Bottom 0.305: R12.2 72.39,57.78 73.66,59.05 77.47,59.05 78.48,60.07 IC4.28 IC4.1 71.85,61.18 71.44,61.59 71.44,62.23 71.37,62.48 | IC4.3 71.37,62.48 | IC4.4 72.02,63.13 71.37,62.48
  Bottom 0.406: IC3.16 36.83,60.33 35.56,61.59 | 35.56,61.59 25.4,61.59 25.4,57.78 13.34,57.78 R16.E | R11.2 56.52,20 61.59,20 62.23,19.37 62.23,15.88 62.87,15.24 69.85,15.24 72.39,13.34 R25.2 74.3,12.7 R23.1 R10.1 | R17.2 36.83,72.14 35.56,70.8 35.56,61.59 | IC11.9 86.04,19.89 86.04,21.59 86.68,22.23 v91.76,22.23
  Bottom 0.61: T2.1 12.06,74.3 LCD.1 13.65,72.39 8.26,66.99 8.26,62.87 R16.E | IC3.16 36.83,59.37 38.42,57.78 L1.1 | L1.1 40.64,54.93 39.37,53.66 39.37,40.01 | 40.32,60.33 40.64,60.01 L1.1
  Bottom 0.813: R9.2 18.41,40.01 39.37,40.01 40.64,40.01 IC1.10 | R9.2 6.99,31.75 6.35,32.38 EXT..2 | R9.2 17.14,31.75 ISP.2 | IC10.IN 94.61,39.05 | 94.61,39.05 94.61,41.59 | 94.61,41.59 IC9.OUT | 94.61,41.59 C12.+ | C10.+ 79.69,42.23 82.87,39.05 94.61,39.05
+12V
  Top 0.61: IC6.10 52.39,76.2 50.48,74.3 45.09,74.3 43.5,72.71 41.59,72.71 40.32,71.44 IR1.2 IR2.2
  Bottom 0.813: IC6.10 59.05,77.47 59.69,78.11 90.17,78.11 90.17,56.52 91.44,55.24 IC5.10 92.71,50.8 | PWR.2 82.23,50.48 82.55,50.8 C14.+ 92.71,50.8 | IC9.IN 93.03,50.8 92.71,50.8
GND
  Bottom 0.305: IC4.24 76.83,63.78 | 76.83,63.78 IC4.5 | IC4.2 74.89,61.83 76.83,63.78
  pour Bottom: 63.5,78.11 63.5,73.66 70.48,73.66 70.48,78.11
  pour Bottom: 83.19,52.07 83.19,58.42 88.27,58.42 88.27,52.07
  pour Bottom: 0,80.01 100.01,80.01 100.01,0 0,0
  pour Top: 0,80.01 100.01,80.01 100.01,0 0,0
  pour Top: 63.82,78.11 63.82,74.61 70.8,73.98 70.8,78.11
  pour Top: 81.6,57.15 81.6,53.66 88.58,53.02 88.58,57.15
  pour Bottom: 72.07,49.21 72.07,44.77 79.06,44.77 79.06,49.21
  pour Top: 72.07,48.58 72.07,45.09 79.06,44.45 79.06,48.58
LED
  Top 0.61: IC1.1 15.88,38.1 15.88,60.33 18.41,62.87 36.83,62.87 38.73,64.77 38.73,73.03 39.37,73.66 40.64,73.66 41.59,74.61 TSOP.2
N$1
  Top 0.406: IC2.17 40.64,12.06 38.42,14.29 32.07,14.29 27.3,19.05 27.3,20 26.67,20.64 22.54,20.64 R6.1
  Bottom 0.406: X1.1 14.61,15.88 16.83,18.1 20.64,18.1 21.27,18.73 R6.1
N$2
  Top 0.406: IC2.16 38.1,10.79 36.2,12.7 32.07,12.7 R5.1
  Bottom 0.406: R5.1 25.4,18.1 24.13,16.83 18.1,16.83 X1.2
N$3
  Bottom 0.305: 17.14,13.34 X1.3
  Bottom 0.406: IC2.13 38.1,15.24 37.47,14.61 34.61,14.61 29.53,9.53 R4.2 24.77,9.53 20.95,13.34 17.14,13.34
N$4
  Bottom 0.406: X1.6 R3.2 22.54,9.53 23.81,8.26 30.16,8.26 35.56,13.65 38.1,13.65 40.64,16.19 IC2.12
N$5
  Bottom 0.406: IC2.27 66.04,8.89 67.63,7.3 67.63,4.45 64.77,1.59 4.45,1.59 3.61,2.43 X1.12
N$6  (via drill 0.8)
  Top 0.406: v15.56,2.86 14.61,2.86 5.08,12.38 2.54,12.38 1.91,13.02 1.91,17.58 X1.9
  Bottom 0.406: v15.56,2.86 64.14,2.86 66.04,4.76 66.04,5.4 63.5,7.94 IC2.26
N$7
  Bottom 0.406: R2.2 10.79,21.59 7.3,21.59 4.45,18.73 4.45,16.83 4.13,16.51 4.13,15.73 X1.10
N$8
  Bottom 0.406: X1.11 1.91,7.82 1.91,15.56 3.49,17.14 3.49,19.37 6.67,22.54 8.57,22.54 R1.2
N$9  (1 unrouted)
  Bottom 0.406: R3.1 R4.1 30.48,6.99 32.7,4.76 35.24,4.76
N$10
  Bottom 0.61: IC2.24 58.42,7.62 59.56,6.48 Q2.1 C3.1
N$11
  Bottom 0.61: IC2.23 55.88,7.62 54.74,6.48 Q2.2 C4.1
N$12
  Bottom 0.305: 12.06,12.06 X1.4
  Bottom 0.406: 12.06,12.06 11.11,13.02 11.11,16.51 16.51,21.91 R6.2 R5.2 L2.2 29.21,23.5 30.48,24.77 C1.1
N$13
  Bottom 0.406: R8.1 43.5,21.91 45.72,19.68 IC2.10
N$14
  Bottom 0.406: R7.2 IC2.14
N$15
  Bottom 0.61: IC2.1 C5.+
N$16
  Bottom 0.61: IC1.12 45.85,36.07 Q1.2 C6.2
N$17
  Bottom 0.61: IC1.13 48.26,33.53 Q1.1 C7.2
N$18
  Bottom 0.406: IC1.5 27.94,34.29 30.48,31.75 32.38,31.75 40.01,24.13 43.18,24.13 48.26,19.05 IC2.9
N$19  (via drill 0.9)
  Top 0.406: IC8.2 85.9,10.62 v82.55,13.97
  Bottom 0.406: IC1.17 58.42,29.84 60.96,27.3 60.96,22.23 61.59,21.59 65.41,21.59 65.41,24.77 67.63,26.99 71.44,26.99 71.44,24.45 72.71,23.18 78.11,23.18 80.64,20.64 80.64,15.88 v82.55,13.97
N$20
  Bottom 0.406: R25.1 90.49,10.79 93.34,13.65 | 93.34,13.65 95.89,16.19 95.89,17.78 95.81,17.86 IC11.14 | 78.11,25.08 81.92,21.27 81.92,16.83 84.77,13.97 93.03,13.97 93.34,13.65
  Bottom 0.61: IC1.27 50.8,49.53 53.34,46.99 69.22,46.99 69.53,46.67 69.53,42.86 71.75,40.64 78.74,40.64 80.01,39.37 80.01,34.92 78.11,33.34 78.11,25.08
N$21
  Bottom 0.406: IC1.16 55.88,33.97 57.15,32.7 57.15,29.53 59.69,26.99 59.69,22.23 60.96,20.95 66.36,20.95 66.36,24.45 67.94,26.04 70.48,26.04 70.48,23.18 71.75,21.91 75.25,21.91 75.88,21.27 JP1.2
N$22
  Bottom 0.406: C8.2 IC1.32
N$23
  Bottom 0.406: IC1.3 22.86,34.92 24.13,33.66 26.04,33.66 28.89,30.8 31.75,30.8 42.23,20.32 43.5,20.32 44.45,19.37 44.45,14.61 45.09,13.97 59.69,13.97 60.96,15.24 IC2.4
N$24  (via drill 0.8)
  Top 0.406: v30.48,27.3 38.1,34.92 IC1.9
  Bottom 0.406: R9.1 14.61,29.21 18.41,25.4 23.5,25.4 24.13,26.04 ISP.5 v30.48,27.3
N$25
  Top 0.406: R11.1 81.92,22.86 83.9,20.88 IC8.14
  Bottom 0.406: R11.1 62.23,22.86 62.23,34.92 IC1.19
N$26
  Bottom 0.61: IC1.30 C9.2 L1.2
N$27
  Bottom 0.61: DMX.2 IC7.6
N$29
  Bottom 0.61: IC7.3 IC7.2 71.12,32.07 71.12,34.61 66.67,38.73 61.91,38.73 60.96,37.78 IC1.18
N$30
  Bottom 0.61: DMX.3 IC7.7
N$32
  Bottom 0.61: IC1.15 53.34,40.64 54.29,41.59 68.58,41.59 76.2,33.97 76.2,25.08 IC7.4
N$33
  Bottom 0.61: IC1.14 50.8,34.92 51.75,33.97 53.98,33.97 54.61,34.61 54.61,39.37 55.56,40.32 67.63,40.32 73.03,34.92 IC7.1
N$34
  Top 0.406: IC3.15 34.29,49.53 34.92,48.9 60.33,48.9 60.96,49.53 IC1.23
  Bottom 0.305: IC4.27 79.78,61.83 80.01,61.59 R12.1
  Bottom 0.406: IC1.23 60.96,52.7 62.87,54.61 67.94,54.61 69.22,55.88 78.11,55.88 R12.1
N$35
  Top 0.406: IC3.14 31.75,49.53 33.66,47.62 62.23,47.62 63.5,48.9 IC1.22
  Bottom 0.305: IC4.26 80.39,62.48 80.64,62.23 80.64,59.05 81.92,57.78 81.92,56.52 R13.1
  Bottom 0.406: IC1.22 63.5,52.7 64.14,53.34 80.01,53.34 R13.1
N$36
  Bottom 0.61: R14.1 6.99,59.69 10.16,56.52 26.67,56.52 IC3.12
N$37
  Bottom 0.406: R14.2 5.08,70.8 T2.2
N$38
  Bottom 0.61: R15.1 T2.3
N$39
  Bottom 0.61: R15.2 1.91,62.55 1.91,77.47 2.54,78.11 33.02,78.11 34.29,76.83 34.29,73.66 33.02,72.39 LCD.15
N$40
  Bottom 0.406: IC3.4 29.21,69.85 LCD.11
N$41
  Bottom 0.406: LCD.12 25.4,73.66 25.4,68.58 IC3.5
N$42
  Bottom 0.406: IC3.6 24.13,66.04 25.4,64.77 30.48,64.77 30.48,69.85 29.21,71.12 LCD.13
N$43
  Bottom 0.406: IC3.7 21.59,69.85 22.86,71.12 22.86,76.2 27.94,76.2 LCD.14
N$44
  Bottom 0.406: LCD.4 17.78,73.66 17.78,70.48 16.51,69.22 16.51,63.5 19.05,60.96 IC3.9
N$45
  Bottom 0.406: LCD.5 19.05,69.85 17.78,68.58 17.78,64.77 21.59,60.96 IC3.10
N$46
  Bottom 0.406: LCD.6 20.32,73.66 20.32,64.77 24.13,60.96 IC3.11
N$47
  Top 0.61: IC8.8 95.9,22.24 ANT.1
N$48
  Bottom 0.305: IC4.23 80.64,64.43 80.96,64.14 80.96,63.18 81.92,62.23 81.92,59.05 83.19,57.78 83.19,55.88 81.28,53.98 81.28,52.7 80.64,52.07 70.48,52.07 67.94,49.53 59.69,49.53 58.42,50.8 IC1.24
N$49
  Bottom 0.61: LCD.3 16.51,71.12 13.34,67.94 R16.S
N$50  (1 unrouted)
  Bottom 0.61: TSOP.3 47.31,76.83 47.31,73.98 48.59,72.7 R17.1 48.58,71.83
N$51
  Bottom 0.305: IC4.15 81.69,69.63 81.92,69.85 81.92,71.12 82.55,71.75 82.55,73.03 IC5.1
N$52  (1 unrouted)
  Top 0.61: 49.53,58.1 50.48,57.15 50.48,54.29 50.8,53.98 65.41,53.98 66.04,53.34 IC1.21
N$53  (via drill 0.8, 0.9)
  Top 0.406: IC2.8 50.8,19.68 | 50.8,19.68 51.12,20 70.48,20 70.48,16.51 v85.09,16.51 85.9,17.32 IC8.13 | 50.8,19.68 48.9,21.59 v48.9,25.4 | IC1.8 35.56,34.61 v30.48,29.53
  Bottom 0.406: v48.9,25.4 47.62,25.4 45.09,27.94 40.64,27.94 39.37,29.21 39.37,32.38 IC1.8 | ISP.3 22.86,28.57 27.94,28.57 28.89,29.53 v30.48,29.53 | IC11.13 93.81,16.34 92.71,15.24 86.36,15.24 v85.09,16.51
N$54
  Bottom 0.61: IC1.20 66.04,34.29 66.67,33.66 1W.2 66.67,27.62 65.09,26.04 R19.2
N$55
  Bottom 0.61: T1.2 47.45,59.2 R20.1
N$56
  Bottom 0.305: IC4.16 82.31,68.98 83.19,69.85 83.19,71.12 IC5.2
N$57
  Bottom 0.61: R21.2 R22.1 48.58,63.65 T1.3
N$58
  Bottom 0.61: IR1.1 43.18,69.53 R21.1
N$59
  Bottom 0.305: IC4.17 82.94,68.33 IC5.3
N$60
  Bottom 0.305: IC4.18 84.83,67.68 IC5.4
N$61
  Bottom 0.305: IC4.19 83.47,67.03 IC5.5
N$62
  Bottom 0.305: IC4.20 82.84,66.38 83.19,66.04 83.19,64.77 IC5.6
N$63
  Bottom 0.305: IC4.21 82.22,65.73 82.55,65.41 82.55,64.14 83.19,63.5 83.19,62.23 IC5.7
N$64
  Bottom 0.305: IC4.22 81.61,65.08 81.92,64.77 81.92,63.5 82.55,62.87 82.55,60.33 IC5.8
N$65
  Bottom 0.305: IC4.6 71.42,64.43 69.85,62.87 69.85,61.59 69.22,60.96 69.22,59.69 68.58,59.05 68.58,57.78 IC6.1
N$66
  Bottom 0.305: IC4.8 70.17,65.73 68.58,64.14 68.58,62.87 IC6.3
N$67
  Bottom 0.305: IC4.7 70.8,65.08 69.22,63.5 69.22,62.23 68.58,61.59 68.58,60.33 IC6.2
N$68
  Bottom 0.305: IC4.10 66.67,67.03 IC6.5
N$69
  Bottom 0.305: IC4.9 68.58,66.38 68.58,65.41 IC6.4
N$70
  Bottom 0.305: IC4.12 69.47,68.33 IC6.7
N$71
  Bottom 0.305: IC4.11 67.58,67.68 IC6.6
N$72
  Bottom 0.305: IC4.13 70.08,68.98 69.85,69.22 69.85,69.85 68.58,71.12 68.58,72.39 IC6.8
N$73
  Bottom 1.016: PWM1.6 IC6.13
N$74
  Bottom 1.016: PWM1.2 IC6.17
N$75
  Bottom 1.016: IC5.18 PWM2.1
N$76
  Bottom 1.016: PWM2.2 IC5.17
N$77
  Bottom 1.016: IC5.16 PWM2.3
N$78
  Bottom 1.016: PWM2.4 IC5.15
N$79
  Bottom 1.016: PWM2.5 IC5.14
N$80
  Bottom 1.016: IC5.13 PWM2.6
N$81
  Bottom 1.016: PWM2.7 IC5.12
N$82
  Bottom 1.016: IC5.11 PWM2.8
N$83
  Bottom 1.016: PWM1.8 IC6.11
N$84
  Bottom 1.016: IC6.12 PWM1.7
N$85
  Bottom 1.016: IC6.14 PWM1.5
N$86
  Bottom 1.016: PWM1.4 IC6.15
N$87
  Bottom 1.016: IC6.16 PWM1.3
N$88
  Bottom 1.016: IC6.18 PWM1.1
N$89
  Bottom 0.61: IC1.25 55.88,49.53 57.15,48.26 69.85,48.26 70.8,47.31 70.8,44.77 R18.1
N$90
  Bottom 0.61: IC1.33 35.56,50.16 28.57,43.18 19.05,43.18 9.53,33.66 EXT..1
N$91
  Bottom 0.61: IC1.34 33.02,50.16 27.3,44.45 17.78,44.45 9.53,36.2 EXT..3
N$92
  Bottom 0.61: IC1.35 30.48,50.16 26.04,45.72 16.51,45.72 9.53,38.73 EXT..5
N$93
  Bottom 0.61: IC1.36 27.94,50.16 24.77,46.99 15.24,46.99 9.53,41.27 EXT..7
N$94
  Bottom 0.61: IC1.37 25.4,50.16 23.5,48.26 13.97,48.26 9.53,43.81 EXT..9
N$95
  Bottom 0.61: IC1.38 22.86,53.34 20.95,55.24 16.51,55.24 15.24,53.98 6.99,53.98 1.91,48.9 1.91,39.37 5.08,36.2 EXT..4
N$96
  Bottom 0.61: IC1.39 20.32,53.34 19.68,53.98 17.14,53.98 15.88,52.7 7.62,52.7 3.17,48.26 3.17,40.64 5.08,38.73 EXT..6
N$97
  Bottom 0.61: IC1.40 8.26,51.44 4.45,47.62 4.45,41.91 5.08,41.27 EXT..8
N$98  (via drill 0.9)
  Top 0.406: 53.34,19.05 IC2.7 | v87.95,16.51 87.95,17.37 87.9,17.41 IC8.12 87.9,16.46 86.68,15.24 v58.42,15.24
  Bottom 0.406: ISP.4 21.59,37.47 22.23,38.1 29.84,38.1 30.48,37.47 IC1.6 30.48,33.66 31.11,33.02 32.38,33.02 40.01,25.4 43.81,25.4 49.53,19.68 52.7,19.68 53.34,19.05 IC2.7 53.34,15.88 53.98,15.24 v58.42,15.24 | IC11.12 91.81,16.56 91.76,16.51 v87.95,16.51
N$99
  Top 0.406: R18.2 74.61,41.59 LED.2
N$100
  Bottom 0.61: R22.2 44.13,66.99 42.86,65.72 IR2.1
N$101  (via drill 0.8, 0.9)
  Top 0.406: v19.05,33.97 32.07,33.97 33.02,34.92 IC1.7
  Top 0.61: IC2.6 55.88,13.02 70.8,13.02 70.8,7.3 74.61,7.3 74.93,7.3 76.83,5.4 81.6,5.4 82.55,6.35 v83.82,6.35 83.82,2.54 83.9,2.62 IC8.1
  Bottom 0.406: IC1.7 33.02,34.92 34.29,33.66 36.2,33.66 38.1,31.75 38.1,28.57 40.01,26.67 44.45,26.67 50.16,20.95 53.34,20.95 55.88,18.41 IC2.6 | ISP.1 20.32,28.57 20.32,32.7 v19.05,33.97 | IC11.1 95.89,3.73 95.89,6.35 v83.82,6.35
N$103  (via drill 0.6)
  Top 0.406: v77.15,6.67 76.83,6.99 76.83,9.21 75.88,10.16 v75.88,14.29
  Bottom 0.406: IC11.3 91.76,3.6 91.76,1.27 91.44,0.95 78.11,0.95 77.15,1.91 R23.2 v77.15,6.67 | v75.88,14.29 73.34,16.83 JP1.1
N$104  (via drill 0.9)
  Top 0.406: v89.22,12.06 89.85,12.06 93.98,8.26 v94.61,7.62
  Bottom 0.406: IC11.2 93.81,1.13 93.98,0.95 97.16,0.95 97.47,1.27 97.47,7.62 v94.61,7.62 | JP1.3 78.42,15.88 80.33,13.97 80.64,13.97 80.96,13.65 80.96,12.7 81.6,12.06 v89.22,12.06
N$105
  Bottom 0.61: IC11.8 83.81,21.26 86.04,23.5 90.17,23.5 ANT1.1
N$106
  Top 0.406: R10.2 79.38,1.91 80.01,1.27 87.9,1.27 IC8.3

### Text on the board
Top: This project "reembox" © 2013 Jonas Eickhoff is licensed under the Creative Commons Attribution-ShareAlike 3.0 Unported License: http://creativecommons.org/licenses/by-sa/3.0/